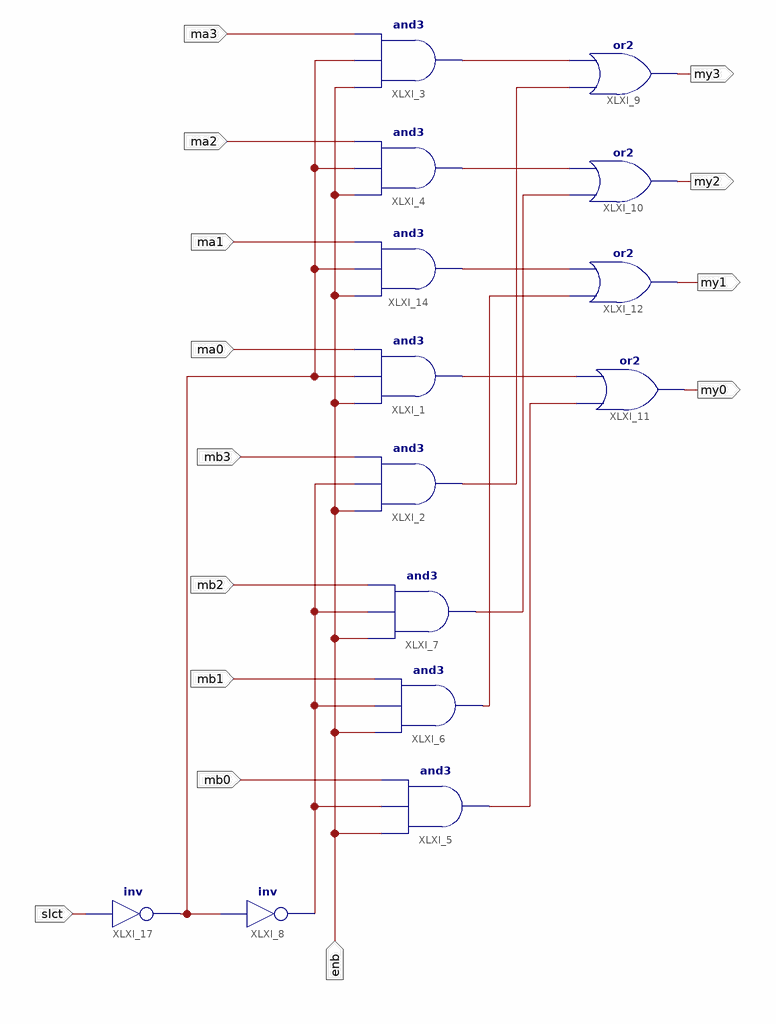
[diagram p0: schematic sheet 1]
// Xilinx ISE schematic QuadMux2.sch (xc9500xl) as structural Verilog: 14 symbols, 14 ports
module QuadMux2 (
  input  ma3,
  input  ma2,
  input  ma1,
  input  ma0,
  input  mb3,
  input  mb2,
  input  mb1,
  input  mb0,
  input  slct,
  input  enb,
  output my3,
  output my2,
  output my1,
  output my0
);

  wire slc, XLXN_9, XLXN_52, XLXN_53, XLXN_54, XLXN_55, XLXN_56, XLXN_57, XLXN_58, XLXN_59;

  and XLXI_1 (XLXN_55, enb, slc, ma0);
  and XLXI_2 (XLXN_56, enb, XLXN_9, mb3);
  and XLXI_3 (XLXN_52, enb, slc, ma3);
  and XLXI_4 (XLXN_53, enb, slc, ma2);
  and XLXI_5 (XLXN_59, enb, XLXN_9, mb0);
  and XLXI_6 (XLXN_58, enb, XLXN_9, mb1);
  and XLXI_7 (XLXN_57, enb, XLXN_9, mb2);
  not XLXI_8 (XLXN_9, slc);
  or XLXI_9 (my3, XLXN_56, XLXN_52);
  or XLXI_10 (my2, XLXN_57, XLXN_53);
  or XLXI_11 (my0, XLXN_59, XLXN_55);
  or XLXI_12 (my1, XLXN_58, XLXN_54);
  not XLXI_17 (slc, slct);
  and XLXI_14 (XLXN_54, enb, slc, ma1);
endmodule
